# Altium schematic sheet LED_String_QBHP686.SchDoc: STB Light Board - 470nm String
size A4; Author: flmoll; DrawnBy: flmoll; Organization: PBL; Revision: A; SheetNumber: 3; SheetTotal: 20
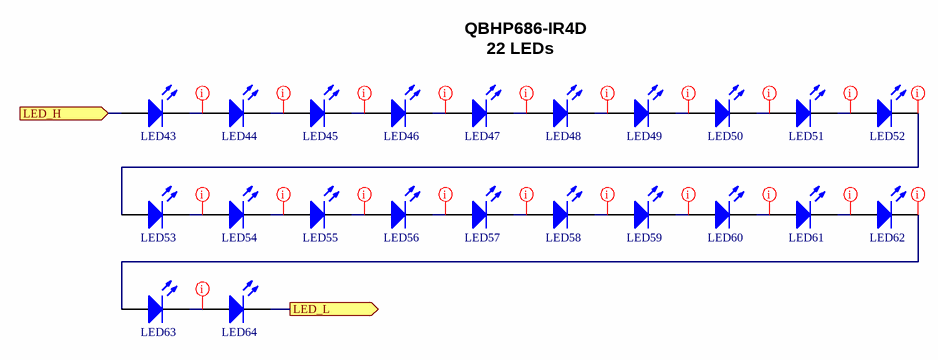
[diagram p0: LED_String_QBHP686.SchDoc]

## Parts
LED43  QBHP686-IR4D  [QBHP686-IR4D]  (value not drawn)
LED44  QBHP686-IR4D  [QBHP686-IR4D]  (value not drawn)
LED45  QBHP686-IR4D  [QBHP686-IR4D]  (value not drawn)
LED46  QBHP686-IR4D  [QBHP686-IR4D]  (value not drawn)
LED47  QBHP686-IR4D  [QBHP686-IR4D]  (value not drawn)
LED48  QBHP686-IR4D  [QBHP686-IR4D]  (value not drawn)
LED49  QBHP686-IR4D  [QBHP686-IR4D]  (value not drawn)
LED50  QBHP686-IR4D  [QBHP686-IR4D]  (value not drawn)
LED51  QBHP686-IR4D  [QBHP686-IR4D]  (value not drawn)
LED52  QBHP686-IR4D  [QBHP686-IR4D]  (value not drawn)
LED53  QBHP686-IR4D  [QBHP686-IR4D]  (value not drawn)
LED54  QBHP686-IR4D  [QBHP686-IR4D]  (value not drawn)
LED55  QBHP686-IR4D  [QBHP686-IR4D]  (value not drawn)
LED56  QBHP686-IR4D  [QBHP686-IR4D]  (value not drawn)
LED57  QBHP686-IR4D  [QBHP686-IR4D]  (value not drawn)
LED58  QBHP686-IR4D  [QBHP686-IR4D]  (value not drawn)
LED59  QBHP686-IR4D  [QBHP686-IR4D]  (value not drawn)
LED60  QBHP686-IR4D  [QBHP686-IR4D]  (value not drawn)
LED61  QBHP686-IR4D  [QBHP686-IR4D]  (value not drawn)
LED62  QBHP686-IR4D  [QBHP686-IR4D]  (value not drawn)
LED63  QBHP686-IR4D  [QBHP686-IR4D]  (value not drawn)
LED64  QBHP686-IR4D  [QBHP686-IR4D]  (value not drawn)

## Ports
LED_H (in, see LED_Driver_QBHP686[2A]), LED_L (out, see LED_Driver_QBHP686[2A])

## Nets
LED_H: LED43.2(A) ; port LED_H
LED_L: LED64.1(K) ; port LED_L
NetLED43_1: LED43.1(K) LED44.2(A)
NetLED44_1: LED44.1(K) LED45.2(A)
NetLED45_1: LED45.1(K) LED46.2(A)
NetLED46_1: LED46.1(K) LED47.2(A)
NetLED47_1: LED47.1(K) LED48.2(A)
NetLED48_1: LED48.1(K) LED49.2(A)
NetLED49_1: LED49.1(K) LED50.2(A)
NetLED50_1: LED50.1(K) LED51.2(A)
NetLED51_1: LED51.1(K) LED52.2(A)
NetLED52_1: LED52.1(K) LED53.2(A)
NetLED53_1: LED53.1(K) LED54.2(A)
NetLED54_1: LED54.1(K) LED55.2(A)
NetLED55_1: LED55.1(K) LED56.2(A)
NetLED56_1: LED56.1(K) LED57.2(A)
NetLED57_1: LED57.1(K) LED58.2(A)
NetLED58_1: LED58.1(K) LED59.2(A)
NetLED59_1: LED59.1(K) LED60.2(A)
NetLED60_1: LED60.1(K) LED61.2(A)
NetLED61_1: LED61.1(K) LED62.2(A)
NetLED62_1: LED62.1(K) LED63.2(A)
NetLED63_1: LED63.1(K) LED64.2(A)

## Layout directives
net class LED: NetLED43_1, NetLED44_1, NetLED45_1, NetLED46_1, NetLED47_1, NetLED48_1, NetLED49_1, NetLED50_1, NetLED51_1, NetLED52_1, NetLED53_1, NetLED54_1, NetLED55_1, NetLED56_1, NetLED57_1, NetLED58_1, NetLED59_1, NetLED60_1, NetLED61_1, NetLED62_1, NetLED63_1

## Notes on the sheet
- QBHP686-IR4D
- 22 LEDs
- 1
- 2
- 3
- 4
- A
- B
- C
- Project:
- D
- Date:
- Drawing number:
- Rev:
- Format:
- A4 Q
- Drawn by:
- Laboratory:
- Page
- Sheet:
- of
- File:

## Library data of the parts
LED43-LED64 = CMP-02055-1: Infrared (IR) Emitter 740nm 1.8V 100mA 5.6mW/sr @ 50mA 120° 1411 (3528 Metric); Mfr: QT Brightek (QTB); Manufacturer: QT-Brightek; Series: Mid Power; Type: Infrared (IR); Current - DC Forward (If) (Max): 100mA; Radiant Intensity (Ie) Min @ If: 5.6mW/sr @ 50mA; Wavelength: 740nm; Voltage - Forward (Vf) (Typ): 1.8V; Viewing Angle: 120°; Orientation: Top View; Operating Temperature: -40°C ~ 80°C; Mounting Type: Surface Mount; Package / Case: 1411 (3528 Metric); Base Product Number: QBHP686; Supplier 1: Digi-Key; Supplier Part Number 1: 1516-QBHP686-IR4DCT-ND; Manufacturer Part Number: QBHP686-IR4D; RoHS: No; Stock 1: 1500; Pricing 1: 1=0.92000, 10=0.60000, 100=0.39330, 1000=0.31050 (USD)